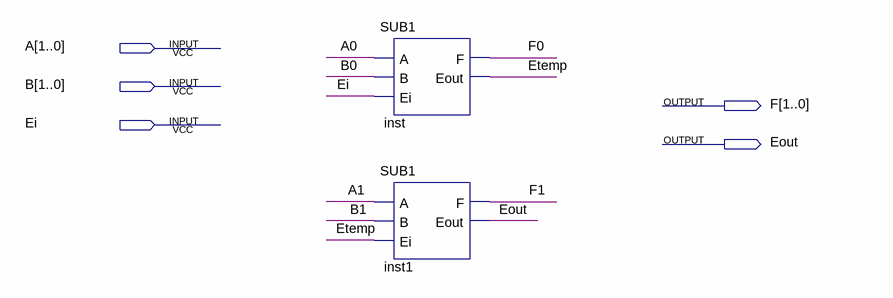
[diagram p0: schematic sheet]
// Quartus schematic SUB2.bdf as structural Verilog: 2 symbols, 5 pins
module SUB2 (
  input  [1:0] A,
  input  [1:0] B,
  input  Ei,
  output [1:0] F,
  output Eout
);

  wire Etemp;

  SUB1 inst (.A(A[0]), .B(B[0]), .Ei(Ei), .F(F[0]), .Eout(Etemp));
  SUB1 inst1 (.A(A[1]), .B(B[1]), .Ei(Etemp), .F(F[1]), .Eout(Eout));
endmodule
